# EAGLE schematic V0.2 (EAGLE 9.5.2)
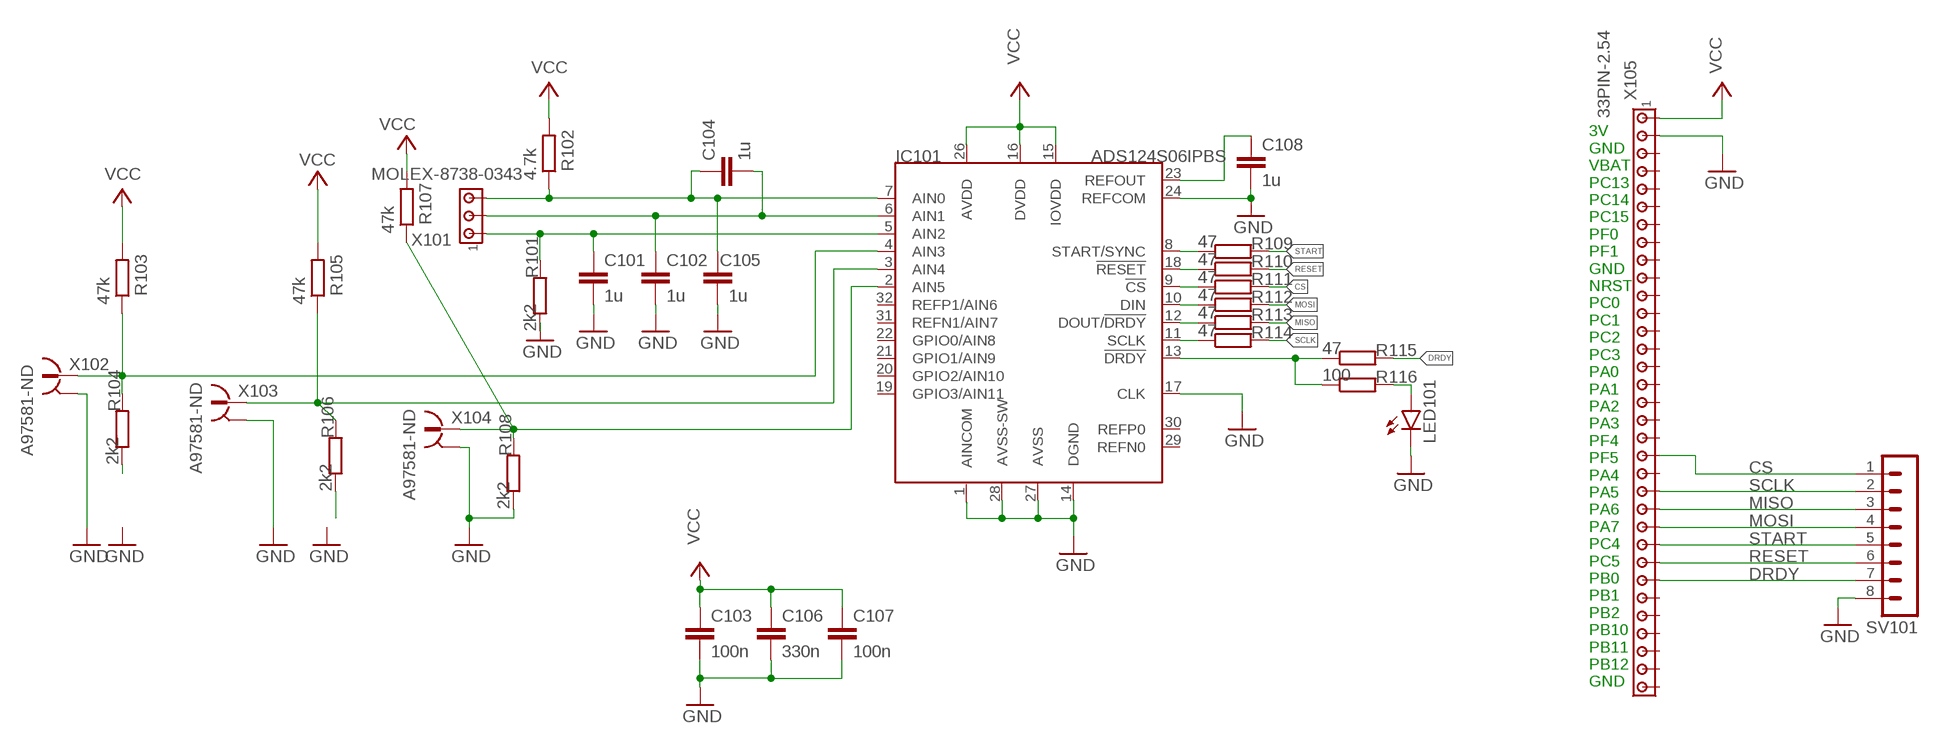
[diagram p0: schematic, sheet 1]

## Parts
C101  1u  C-EUC0603  [C0603]
C102  1u  C-EUC0603  [C0603]
C103  100n  C-EUC0603  [C0603]
C104  1u  C-EUC0603  [C0603]
C105  1u  C-EUC0603  [C0603]
C106  330n  C-EUC0603  [C0603]
C107  100n  C-EUC0603  [C0603]
C108  1u  C-EUC0603  [C0603]
IC101  ADS124S06IPBS  ADS124S0XIPBS  [TQFP32-05]
LED101  LEDSML0603  [SML0603]
R101  2k2  R-EU_R0805W  [R0805W]
R102  4.7k  R-EU_R0603  [R0603]
R103  47k  R-EU_R0603  [R0603]
R104  2k2  R-EU_R0805W  [R0805W]
R105  47k  R-EU_R0603  [R0603]
R106  2k2  R-EU_R0805W  [R0805W]
R107  47k  R-EU_R0603  [R0603]
R108  2k2  R-EU_R0805W  [R0805W]
R109  47  R-EU_R0603  [R0603]
R110  47  R-EU_R0603  [R0603]
R111  47  R-EU_R0603  [R0603]
R112  47  R-EU_R0603  [R0603]
R113  47  R-EU_R0603  [R0603]
R114  47  R-EU_R0603  [R0603]
R115  47  R-EU_R0603  [R0603]
R116  100  R-EU_R0603  [R0603]
SV101  MA08-1  [MA08-1]
X101  MOLEX-8738-0343  [MOLEX-87438-0343]
X102  A97581-ND  [1634503]
X103  A97581-ND  [1634503]
X104  A97581-ND  [1634503]
X105  33PIN-2.54  [1X33]

## Nets
AIN0: C104.1 C105.1 IC101.7(AIN0) R102.1 X101.3 X101.3_1
AIN1: C102.1 C104.2 IC101.6(AIN1) X101.2 X101.2_1
AIN2: C101.1 IC101.5(AIN2) R101.2 X101.1 X101.1_1
CS: R111.2 SV101.1 X105.20
DRDY: R115.2 SV101.7 X105.27
GND [New Class]: C101.2 C102.2 C103.2 C105.2 C106.2 C107.2 C108.2 IC101.1(AINCOM) IC101.14(DGND) IC101.17(CLK) IC101.24(REFCOM) IC101.27(AVSS) IC101.28(AVSS-SW) LED101.C R101.1 R108.1 SV101.8 X102.2 X102.3 X102.4 X102.5 X103.2 X103.3 X103.4 X103.5 X104.2 X104.3 X104.4 X104.5 X105.2
MISO: R113.2 SV101.3 X105.23
MOSI: R112.2 SV101.4 X105.24
N$1: IC101.8(START/SYNC) R109.1
N$2: IC101.18(!RESET) R110.1
N$3: IC101.9(!CS) R111.1
N$4: IC101.10(DIN) R112.1
N$5: IC101.12(DOUT/!DRDY) R113.1
N$6: IC101.11(SCLK) R114.1
N$7: IC101.13(!DRDY) R115.1 R116.1
N$8 [New Class]: R104.1
N$9 [New Class]: R106.1
N$11: IC101.4(AIN3) R103.1 R104.2 X102.1
N$14: LED101.A R116.2
N$15: C108.1 IC101.23(REFOUT)
N$17: IC101.3(AIN4) R105.1 R106.2 X103.1
N$18: IC101.2(AIN5) R107.1 R108.2 X104.1
RESET: R110.2 SV101.6 X105.26
SCLK: R114.2 SV101.2 X105.22
START: R109.2 SV101.5 X105.25
VCC: C103.1 C106.1 C107.1 IC101.15(IOVDD) IC101.16(DVDD) IC101.26(AVDD) R102.2 R103.2 R105.2 R107.2 X105.1
Unconnected: IC101.19(GPIO3/AIN11) IC101.20(GPIO2/AIN10) IC101.21(GPIO1/AIN9) IC101.22(GPIO0/AIN8) IC101.29(REFN0) IC101.30(REFP0) IC101.31(REFN1/AIN7) IC101.32(REFP1/AIN6) X105.3 X105.4 X105.5 X105.6 X105.7 X105.8 X105.9 X105.10 X105.11 X105.12 X105.13 X105.14 X105.15 X105.16 X105.17 X105.18 X105.19 X105.21 X105.28 X105.29 X105.30 X105.31 X105.32 X105.33

## Notes on the sheet
- 3V
  GND
  VBAT
  PC13
  PC14
  PC15
  PF0
  PF1
  GND
  NRST
  PC0
  PC1
  PC2
  PC3
  PA0
  PA1
  PA2
  PA3
  PF4
  PF5
  PA4
  PA5
  PA6
  PA7
  PC4
  PC5
  PB0
  PB1
  PB2
  PB10
  PB11
  PB12
  GND

## Library data of the parts
C101 C102 C104 C105 C108 = rcl:C-EU: CAPACITOR, European symbol; DIGIKEY_NR: 1276-1182-1-ND; DIGIKEY_PRICE: 0.10; SPICEPREFIX: C
C103 C107 = rcl:C-EU: CAPACITOR, European symbol; DIGIKEY_NR: 1276-6439-1-ND; DIGIKEY_PRICE: 0.10; SPICEPREFIX: C
C106 = rcl:C-EU: CAPACITOR, European symbol; DIGIKEY_NR: 490-6050-1-ND; DIGIKEY_PRICE: 0.22; SPICEPREFIX: C
IC101 = ADC-Erweiterung:ADS124S0X; DIGIKEY_NR: 296-45188-ND; DIGIKEY_PRICE: 10.15
LED101 = led:LED: LED OSRAM: - CHIPLED LG R971, LG N971, LY N971, LG Q971, LY Q971, LO R971, LY R971 LH N974, LH R974 LS Q976, LO Q976, LY Q976 LO Q996 - Hyper CHIPLED LW Q18S LB Q993, LB Q99A, LB R99A - SideLED LS A670, LO A670, LY A670, LG A670, LP A670 LB A673, LV A673, LT A673, LW A673 LH A674 LY A675 LS A676, LA A676, LO A676, LY A676, LW A676 LS A679, LY A679, LG A679 - Hyper Micro SIDELED® LS Y876, LA Y876, LO Y876, LY Y876 LT Y87S - SmartLED LW L88C, LW L88S LB L89C, LB L89S, LG L890 LS L89K, LO L89K, LY L89K LS L896, LA L896, LO L896, LY L896 - TOPLED LS T670, LO T670, LY T670, LG T670, LP T670 LSG T670, LSP T670, LSY T670, LOP T670, LYG T670 LG T671, LOG T671, LSG T671 LB T673, LV T673, LT T673, LW T673 LH T674 LS T676, LA T676, LO T676, LY T676, LB T676, LH T676, LSB T676, LW T676 LB T67C, LV T67C, LT T67C, LS T67K, LO T67K, LY T67K, LW E67C LS E67B, LA E67B, LO E67B, LY E67B, LB E67C, LV E67C, LT E67C LW T67C LS T679, LY T679, LG T679 LS T770, LO T770, LY T770, LG T770, LP T770 LB T773, LV T773, LT T773, LW T773 LH T774 LS E675, LA E675, LY E675, LS T675 LS T776, LA T776, LO T776, LY T776, LB T776 LHGB T686 LT T68C, LB T68C - Hyper Mini TOPLED® LB M676 - Mini TOPLED Santana® LG M470 LS M47K, LO M47K, LY M47K Source: http://www.osram.convergy.de LUXEON: - LUMILED® LXK2-PW12-R00, LXK2-PW12-S00, LXK2-PW14-U00, LXK2-PW14-V00 LXK2-PM12-R00, LXK2-PM12-S00, LXK2-PM14-U00 LXK2-PE12-Q00, LXK2-PE12-R00, LXK2-PE12-S00, LXK2-PE14-T00, LXK2-PE14-U00 LXK2-PB12-K00, LXK2-PB12-L00, LXK2-PB12-M00, LXK2-PB14-N00, LXK2-PB14-P00, LXK2-PB14-Q00 LXK2-PR12-L00, LXK2-PR12-M00, LXK2-PR14-Q00, LXK2-PR14-R00 LXK2-PD12-Q00, LXK2-PD12-R00, LXK2-PD12-S00 LXK2-PH12-R00, LXK2-PH12-S00 LXK2-PL12-P00, LXK2-PL12-Q00, LXK2-PL12-R00 Source: www.luxeon.com KINGBRIGHT: KA-3528ASYC Source: www.kingbright.com; DIGIKEY_NR: 475-3118-1-ND; DIGIKEY_PRICE: 0.52
R101 R104 R106 R108 = rcl:R-EU_: RESISTOR, European symbol; DIGIKEY_NR: 408-1635-1-ND; DIGIKEY_PRICE: 4.37; SPICEPREFIX: R
R102 = rcl:R-EU_: RESISTOR, European symbol; DIGIKEY_NR: 311-4.70KHRCT-ND; DIGIKEY_PRICE: 0.10; SPICEPREFIX: R
R103 R105 R107 = rcl:R-EU_: RESISTOR, European symbol; DIGIKEY_NR: P123333CT-ND; DIGIKEY_PRICE: 0.10; SPICEPREFIX: R
R109-R115 = rcl:R-EU_: RESISTOR, European symbol; DIGIKEY_NR: 311-470GRCT-ND; DIGIKEY_PRICE: 0.10; SPICEPREFIX: R
R116 = rcl:R-EU_: RESISTOR, European symbol; DIGIKEY_NR: 311-100DCT-ND; DIGIKEY_PRICE: 0.20; SPICEPREFIX: R
SV101 = con-lstb:MA08-1: PIN HEADER; DIGIKEY_NR: 732-5321-ND; DIGIKEY_PRICE: 0.37; OC_FARNELL: unknown; OC_NEWARK: unknown
X101 = ADC-Erweiterung:MOLEX-8738-0343; DIGIKEY_NR: WM7647CT-ND; DIGIKEY_PRICE: 0.81
X102-X104 = ADC-Erweiterung:A97581-ND; DIGIKEY_NR: A97581-ND; DIGIKEY_PRICE: 1.73
X105 = ADC-Erweiterung:33PIN-2.54; DIGIKEY_NR: 609-2223-ND; DIGIKEY_PRICE: 1.41